# Altium schematic sheet ultra_wideband.SchDoc
size 297 x 209 mm; DrawnBy: Supun; Engineer: Supun; Organization: C3
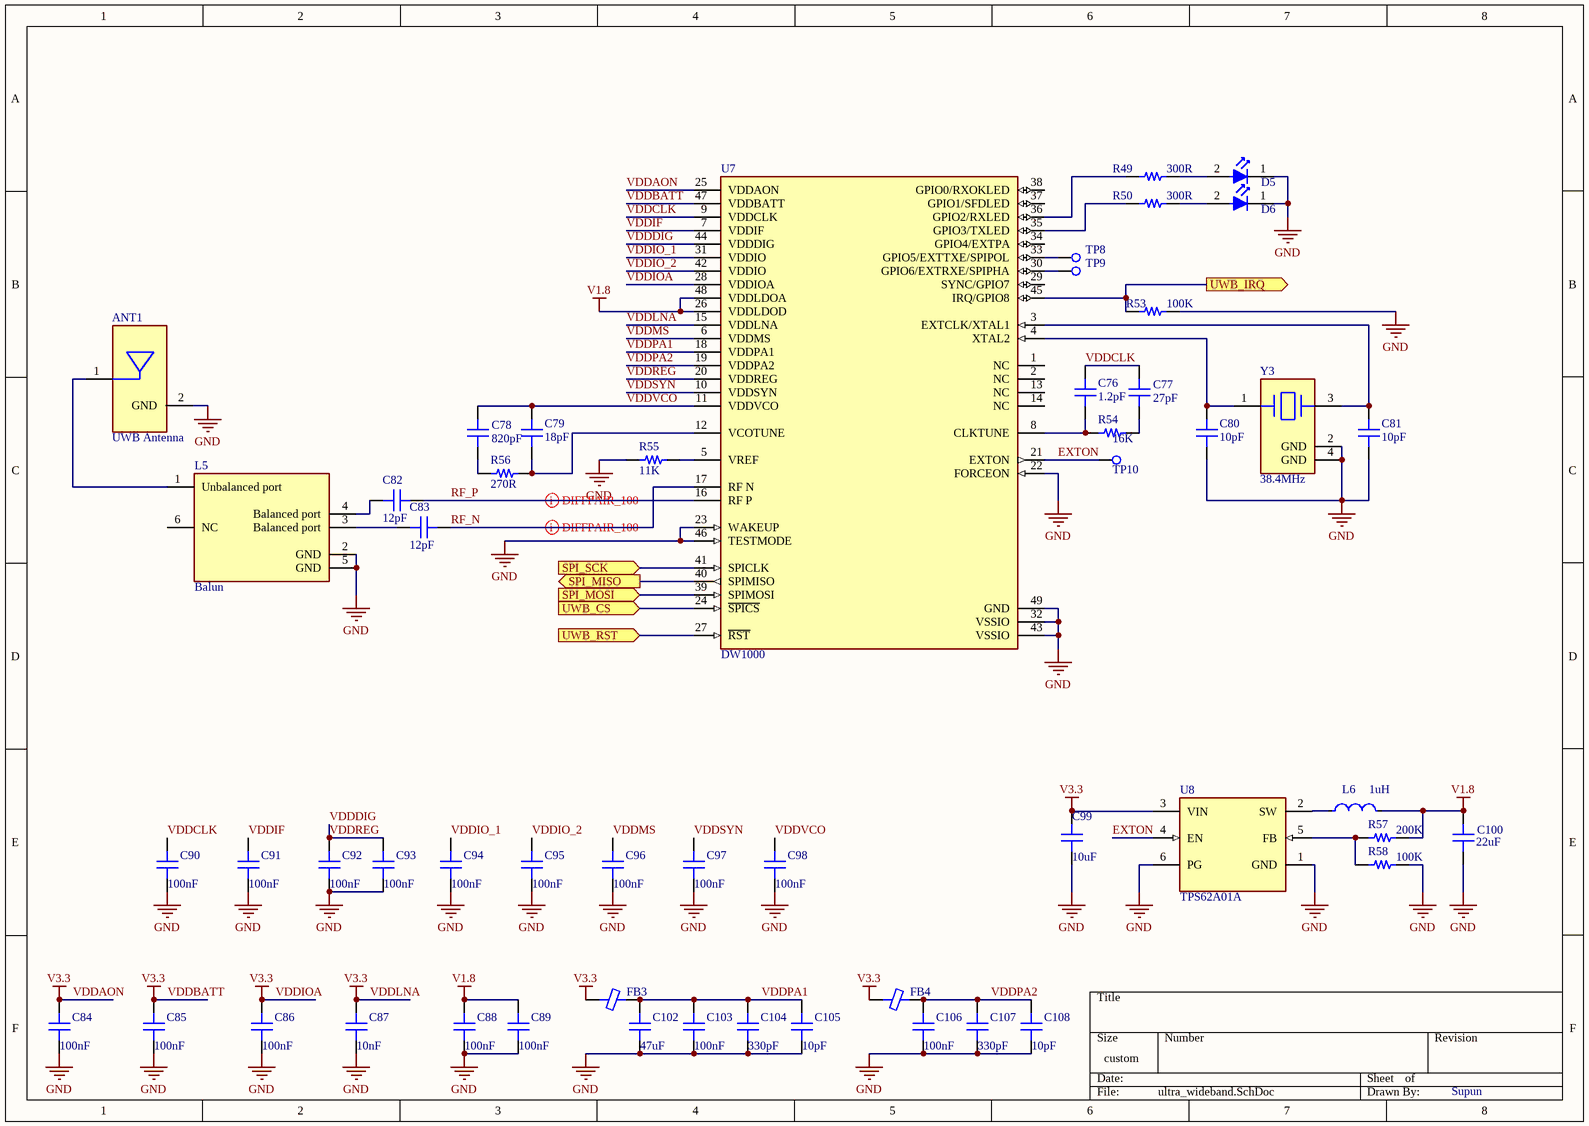
[diagram p0: ultra_wideband.SchDoc]

## Parts
ANT1  UWB Antenna  [UWB_ANTENNA_1]
C76  1.2pF  [CAP 0603_1608]
C77  27pF  [CAP 0603_1608]
C78  820pF  [CAP 0603_1608]
C79  18pF  [CAP 0603_1608]
C80  10pF  [CAP 0603_1608]
C81  10pF  [CAP 0603_1608]
C82  12pF  [CAP 0603_1608]
C83  12pF  [CAP 0603_1608]
C84  100nF  [CAP 0603_1608]
C85  100nF  [CAP 0603_1608]
C86  100nF  [CAP 0603_1608]
C87  10nF  [CAP 0603_1608]
C88  100nF  [CAP 0603_1608]
C89  100nF  [CAP 0603_1608]
C90  100nF  [CAP 0603_1608]
C91  100nF  [CAP 0603_1608]
C92  100nF  [CAP 0603_1608]
C93  100nF  [CAP 0603_1608]
C94  100nF  [CAP 0603_1608]
C95  100nF  [CAP 0603_1608]
C96  100nF  [CAP 0603_1608]
C97  100nF  [CAP 0603_1608]
C98  100nF  [CAP 0603_1608]
C99  10uF  [CAP 0603_1608]
C100  22uF  [CAP 0603_1608]
C102  47uF  [CAP 0603_1608]
C103  100nF  [CAP 0603_1608]
C104  330pF  [CAP 0603_1608]
C105  10pF  [CAP 0603_1608]
C106  100nF  [CAP 0603_1608]
C107  330pF  [CAP 0603_1608]
C108  10pF  [CAP 0603_1608]
D5  Green  [Würth_Elektronik_0_MFG]  (value not drawn)
D6  Red  [Würth_Elektronik_0_MFG]  (value not drawn)
FB3  Ferrite Beads  [Murata_BLM18-0_15-t0_8_MFG]  (value not drawn)
FB4  Ferrite Beads  [Murata_BLM18-0_15-t0_8_MFG]  (value not drawn)
L5  Balun  [TDK_HHM1595A1_MFG]
L6  1uH  [IND 1008_2520]
R49  300R  [RES 0603_1608]
R50  300R  [RES 0603_1608]
R53  100K  [RES 0603_1608]
R54  16K  [RES 0603_1608]
R55  11K  [RES 0603_1608]
R56  270R  [RES 0603_1608]
R57  200K  [RES 0603_1608]
R58  100K  [RES 0603_1608]
TP8  Test Point  [TPSMD_S1]  (value not drawn)
TP9  Test Point  [TPSMD_S1]  (value not drawn)
TP10  Test Point  [TPSMD_S1]  (value not drawn)
U7  DW1000  [Qorvo_1_IPC_B]
U8  TPS62A01A  [TI SOT-563 DRL]
Y3  38.4MHz  [ABRACON ABM8G]

## Ports
SPI_MISO (out), SPI_MOSI (in), SPI_SCK (in), UWB_CS (in), UWB_IRQ (out), UWB_RST (in)

## Nets
GND: ANT1.2(GND) C80.1 C81.1 C84.2 C85.2 C86.2 C87.2 C88.2 C89.2 C90.2 C91.2 C92.2 C93.2 C94.2 C95.2 C96.2 C97.2 C98.2 C99.2 C100.2 C102.1 C103.2 C104.1 C105.1 C106.2 C107.1 C108.1 D5.1(C) D6.1(C) L5.2(GND) L5.5(GND) R53.1 R55.1 R58.2 U7.22(FORCEON) U7.23(WAKEUP) U7.32(VSSIO) U7.43(VSSIO) U7.46(TESTMODE) U7.49(GND) U8.1(GND) U8.6(PG) Y3.2(GND) Y3.4(GND)
V1.8: C88.1 C89.1 C100.1 L6.2 R57.2 U7.26(VDDLDOD) U7.48(VDDLDOA)
VDDAON: C84.1 C85.1 C86.1 C87.1 C99.1 FB3.1 FB4.1 U7.15(VDDLNA) U7.25(VDDAON) U7.28(VDDIOA) U7.47(VDDBATT) U8.3(VIN)  [also labelled V3.3, VDDBATT, VDDIOA, VDDLNA]
EXTON: TP10.1(TP) U7.21(EXTON) U8.4(EN)
RF_N: C83.1 U7.17(RF_N)
RF_P: C82.1 U7.16(RF_P)
SPI_MISO: U7.40(SPIMISO) ; port SPI_MISO
SPI_MOSI: U7.39(SPIMOSI) ; port SPI_MOSI
SPI_SCK: U7.41(SPICLK) ; port SPI_SCK
UWB_CS: U7.24(~{SPICS}) ; port UWB_CS
UWB_IRQ: R53.2 U7.45(IRQ/GPIO8) ; port UWB_IRQ
UWB_RST: U7.27(~{RST}) ; port UWB_RST
VDDCLK: C76.2 C77.2 C90.1 U7.9(VDDCLK)
VDDDIG: C92.1 C93.1 U7.20(VDDREG) U7.44(VDDDIG)  [also labelled VDDREG]
VDDIF: C91.1 U7.7(VDDIF)
VDDIO_1: C94.1 U7.31(VDDIO)
VDDIO_2: C95.1 U7.42(VDDIO)
VDDMS: C96.1 U7.6(VDDMS)
VDDPA1: C102.2 C103.1 C104.2 C105.2 FB3.2 U7.18(VDDPA1)
VDDPA2: C106.1 C107.2 C108.2 FB4.2 U7.19(VDDPA2)
VDDSYN: C97.1 U7.10(VDDSYN)
VDDVCO: C78.2 C79.2 C98.1 U7.11(VDDVCO)
NetANT1_1: ANT1.1 L5.1(Unbalanced_port)
NetC76_1: C76.1 R54.2 U7.8(CLKTUNE)
NetC77_1: C77.1 R54.1
NetC78_1: C78.1 R56.2
NetC79_1: C79.1 R56.1 U7.12(VCOTUNE)
NetC80_2: C80.2 U7.4(XTAL2) Y3.1
NetC81_2: C81.2 U7.3(EXTCLK/XTAL1) Y3.3
NetC82_2: C82.2 L5.4(Balanced_port)
NetC83_2: C83.2 L5.3(Balanced_port)
NetD5_2: D5.2(A) R49.2
NetD6_2: D6.2(A) R50.2
NetL6_1: L6.1 U8.2(SW)
NetR49_1: R49.1 U7.36(GPIO2/RXLED)
NetR50_1: R50.1 U7.35(GPIO3/TXLED)
NetR55_2: R55.2 U7.5(VREF)
NetR57_1: R57.1 R58.1 U8.5(FB)
NetTP8_1: TP8.1(TP) U7.33(GPIO5/EXTTXE/SPIPOL)
NetTP9_1: TP9.1(TP) U7.30(GPIO6/EXTRXE/SPIPHA)

Not connected (* = marked no-connect by the designer): L5 6(NC); U7 1(NC) 2(NC) 13(NC) 14(NC) 29(SYNC/GPIO7) 34(GPIO4/EXTPA) 37(GPIO1/SFDLED) 38(GPIO0/RXOKLED)

## Layout directives
differential pair; differential pair class DIFF100: RF_N, RF_P

## Notes on the sheet
- Title
- Size:
- Date:
- A4
- Number:
- Time:
- Revision:
- Sheet
- of
- File:

## Library data of the parts
ANT1 = UWB PCB Antenna: PCB Antenna; MF: SAH; MP: *; Value: *
C76 = Capacitor: SMT Capacitor; MF: Murata; MP: GRM1885C1H1R2CA01D; Value: 1.2pF; Link: https://www.mouser.com/ProductDetail/Murata-Electronics/GRM1885C1H1R2CA01D?qs=9yYqngZLNofO2BzK0fMtoQ%3D%3D
C77 = Capacitor: SMT Capacitor; MF: Murata; MP: GRM1885C1H270JA01D; Value: 27pF; Link: https://www.mouser.com/ProductDetail/Murata-Electronics/GRM1885C1H270JA01D?qs=Mti35kkwCSM3XwxonqPhaQ%3D%3D
C78 = Capacitor: SMT Capacitor; MF: Murata; MP: GRM1885C1H821JA01D; Value: 820pF; Link: https://www.mouser.com/ProductDetail/Murata-Electronics/GRM1885C1H821JA01D?qs=2MiASeLb%252BOD2kFngltnvvA%3D%3D
C79 = Capacitor: SMT Capacitor; MF: Murata; MP: GRM1885C1H180JA01J; Value: 18pF; Link: https://www.mouser.com/ProductDetail/Murata-Electronics/GRM1885C1H180JA01J?qs=9Cj2FLRihcNL8A7ng%252BzQpQ%3D%3D
C80 C81 C105 C108 = Capacitor: SMT Capacitor; MF: Murata; MP: GRM1885C1H100GA01D; Value: 10pF
  C80 C81: Link: https://www.mouser.com/ProductDetail/Murata-Electronics/GRM1885C1H100GA01D?qs=7Aw3Ng%2FBaE5snYvHxKANnw%3D%3D
  C105 C108: Link: https://
C82 C83 = Capacitor: SMT Capacitor; MF: Murata; MP: GRM1885C1H120JA01J; Value: 12pF; Link: https://www.mouser.com/ProductDetail/Murata-Electronics/GRM1885C1H120JA01J?qs=6X6%252BjuxzJaDbS6LwzBiDtw%3D%3D
C84-C86 C88-C98 C103 C106 = Capacitor: SMT Capacitor; MF: TDK; MP: CGA3E2X7R1E104K080AA; Value: 100nF; Link: https://www.mouser.com/ProductDetail/TDK/CGA3E2X7R1E104K080AA?qs=NRhsANhppD%2Fm7%2FOmmsm0vg%3D%3D
C87 = Capacitor: SMT Capacitor; MF: Murata; MP: GRM1885C1E103JA01D; Value: 10nF; Link: https://www.mouser.com/ProductDetail/Murata-Electronics/GRM1885C1E103JA01D?qs=ui%252B2d9lVEI4mHR%2FJ9wCzmw%3D%3D
C99 = Capacitor: SMT Capacitor; MF: Murata; MP: GRM188R61C106MAALD; Value: 10uF; Link: https://www.mouser.com/ProductDetail/Murata-Electronics/GRM188R61C106MAALD?qs=hNud%2FORuBR3LEOKZ4RJp9w%3D%3D
C100 = Capacitor: SMT Capacitor; MF: Murata; MP: GRM188R61A226ME15D; Value: 22uF; Link: https://www.mouser.com/ProductDetail/Murata-Electronics/GRM188R61A226ME15D?qs=eeBpzGFlv%252B8DV%2FrilzyhAw%3D%3D
C102 = Capacitor: SMT Capacitor; MF: Murata; MP: GRM188R60J476ME15D; Value: 47uF; Link: https://www.mouser.com/ProductDetail/Murata-Electronics/GRM188R60J476ME15D?qs=AEetWsPH0It1A1GvJsMuyQ%3D%3D
C104 C107 = Capacitor: SMT Capacitor; MF: Murata; MP: GRM1885C1H331JA01D; Value: 330pF; Link: https://www.mouser.com/ProductDetail/Murata-Electronics/GRM1885C1H331JA01D?qs=DiwnqUvG%2FIUYCCwNVhuo3w%3D%3D
D5 = LED SMD: Led Diffused SMD; MF: LiteOn; MP: LTST-C190KGKT; Value: Green; Link: https://www.mouser.com/ProductDetail/Lite-On/LTST-C190KGKT?qs=205qCy6M2Q%252BAdcgwUZktqw%3D%3D
D6 = LED SMD: Led Diffused SMD; MF: LiteOn; MP: LTST-C190KRKT; Value: Red; Link: https://www.mouser.com/ProductDetail/Lite-On/LTST-C190KRKT?qs=kAD5fFa1n5VY3YYNWPC1Fg%3D%3D
FB3 FB4 = Ferrite Chip: SMT Ferrite Chip; MF: Murata; MP: BLM18AG601SH1D; Link: https://www.mouser.com/ProductDetail/Murata-Electronics/BLM18AG601SH1D?qs=L3QzcrVjv97OjVi99nCgnA%3D%3D
L5 = HHM1595A1: Signal Conditioning LTCC BALUN 3000-8000MHz; MF: TDK; MP: HHM1595A1; Value: Balun; Link: https://www.mouser.com/ProductDetail/TDK/HHM1595A1?qs=CQ%2FIPMfstfij2T2%252BDRqDhg%3D%3D
L6 = Inductor_sm: Fixed Inductors 2.2uH 20% High Temp AEC-Q200; MF: Murata; MP: DFE252012F-1R0M=P2; Value: 1uH; Link: https://www.mouser.com/ProductDetail/Murata-Electronics/DFE252012F-1R0M%3dP2?qs=ty6qhqyUUEtPvXJAIo0Pnw%3D%3D
R49 R50 = Resistor: SMT Resistor; MF: YAGEO; MP: AC0603FR-07300RL; Value: 300R; Link: https://www.mouser.com/ProductDetail/YAGEO/AC0603FR-07300RL?qs=yhV1fb9g%2FKYRCKndxB9juA%3D%3D
R53 R58 = Resistor: SMT Resistor; MF: YAGEO; MP: AC0603FR-07100KL; Value: 100K; Link: https://www.mouser.com/ProductDetail/YAGEO/AC0603FR-07100KL?qs=UoPT7wUmgYKBKZ83mTH%252BSA%3D%3D
R54 = Resistor: SMT Resistor; MF: YAGEO; MP: AC0603FR-0716KL; Value: 16K; Link: https://www.mouser.com/ProductDetail/YAGEO/AC0603FR-0716KL?qs=yhV1fb9g%2FKbveWp4BLOPMQ%3D%3D
R55 = Resistor: SMT Resistor; MF: YAGEO; MP: AC0603FR-0711KL; Value: 11K; Link: https://www.mouser.com/ProductDetail/YAGEO/AC0603FR-0711KL?qs=yhV1fb9g%2FKb4ptOMRzX2uQ%3D%3D
R56 = Resistor: SMT Resistor; MF: YAGEO; MP: AC0603FR-07270RL; Value: 270R; Link: https://www.mouser.com/ProductDetail/YAGEO/AC0603FR-07270RL?qs=yhV1fb9g%2FKYFLWtESjiWpg%3D%3D
R57 = Resistor: SMT Resistor; MF: YAGEO; MP: AC0603FR-07200KL; Value: 200K; Link: https://www.mouser.com/ProductDetail/YAGEO/AC0603FR-07200KL?qs=sGAEpiMZZMvdGkrng054t2uy2SOblyUPuZUSlNzrwrw%3D
U7 = DW1000: Fully integrated Ultra Wideband (UWB) transceiver IC, IEEE802.15.4-2011, 2-way ranging or TDoA, up to 6.8 Mbps; MF: Qorvo; MP: DW1000-I-TR13; Parameter 1: *; Link: https://www.mouser.com/ProductDetail/Qorvo/DW1000-I-TR13?qs=TiOZkKH1s2SHqHtNDSAfuQ%3D%3D
U8 = TPS62A01A: Switching Voltage Regulators 2.5-V to 5.5-V input, 1-A high-efficiency step-down converter with forced PWM in SOT-563 package; MF: Texas Instruments; MP: TPS62A01ADRLR; Link: https://www.mouser.com/ProductDetail/Texas-Instruments/TPS62A01ADRLR?qs=tlsG%2FOw5FFjxQ1CGo801Kw%3D%3D
Y3 = Crystal: Crystals AEC-Q200 CRYSTAL 4pin SMD; MF: ECS; MP: ECS-384-10-33B-CKY-TR; Value: 38.4MHz; Link: https://www.mouser.com/ProductDetail/ECS/ECS-384-10-33B-CKY-TR?qs=wd5RIQLrsJh9q4Mm6EsgEw%3D%3D
TP8-TP10 = Test Point: Link: https://